# Altium schematic sheet interlinkP1B.SchDoc: Board-to-Board P1B
size Legal; CheckedBy: J. Brinton; CompanyName: Signal Laboratories, Inc.; DrawnBy: J. Brinton; Engineer: J. Brinton; Address1: 3479 Edison Way; Address2: Menlo Park CA 94025; Address3: +1 (877) 778-8435; Address4: siglabs.com; DocumentNumber: 43; Revision: 2b; SheetNumber: 44; SheetTotal: 58
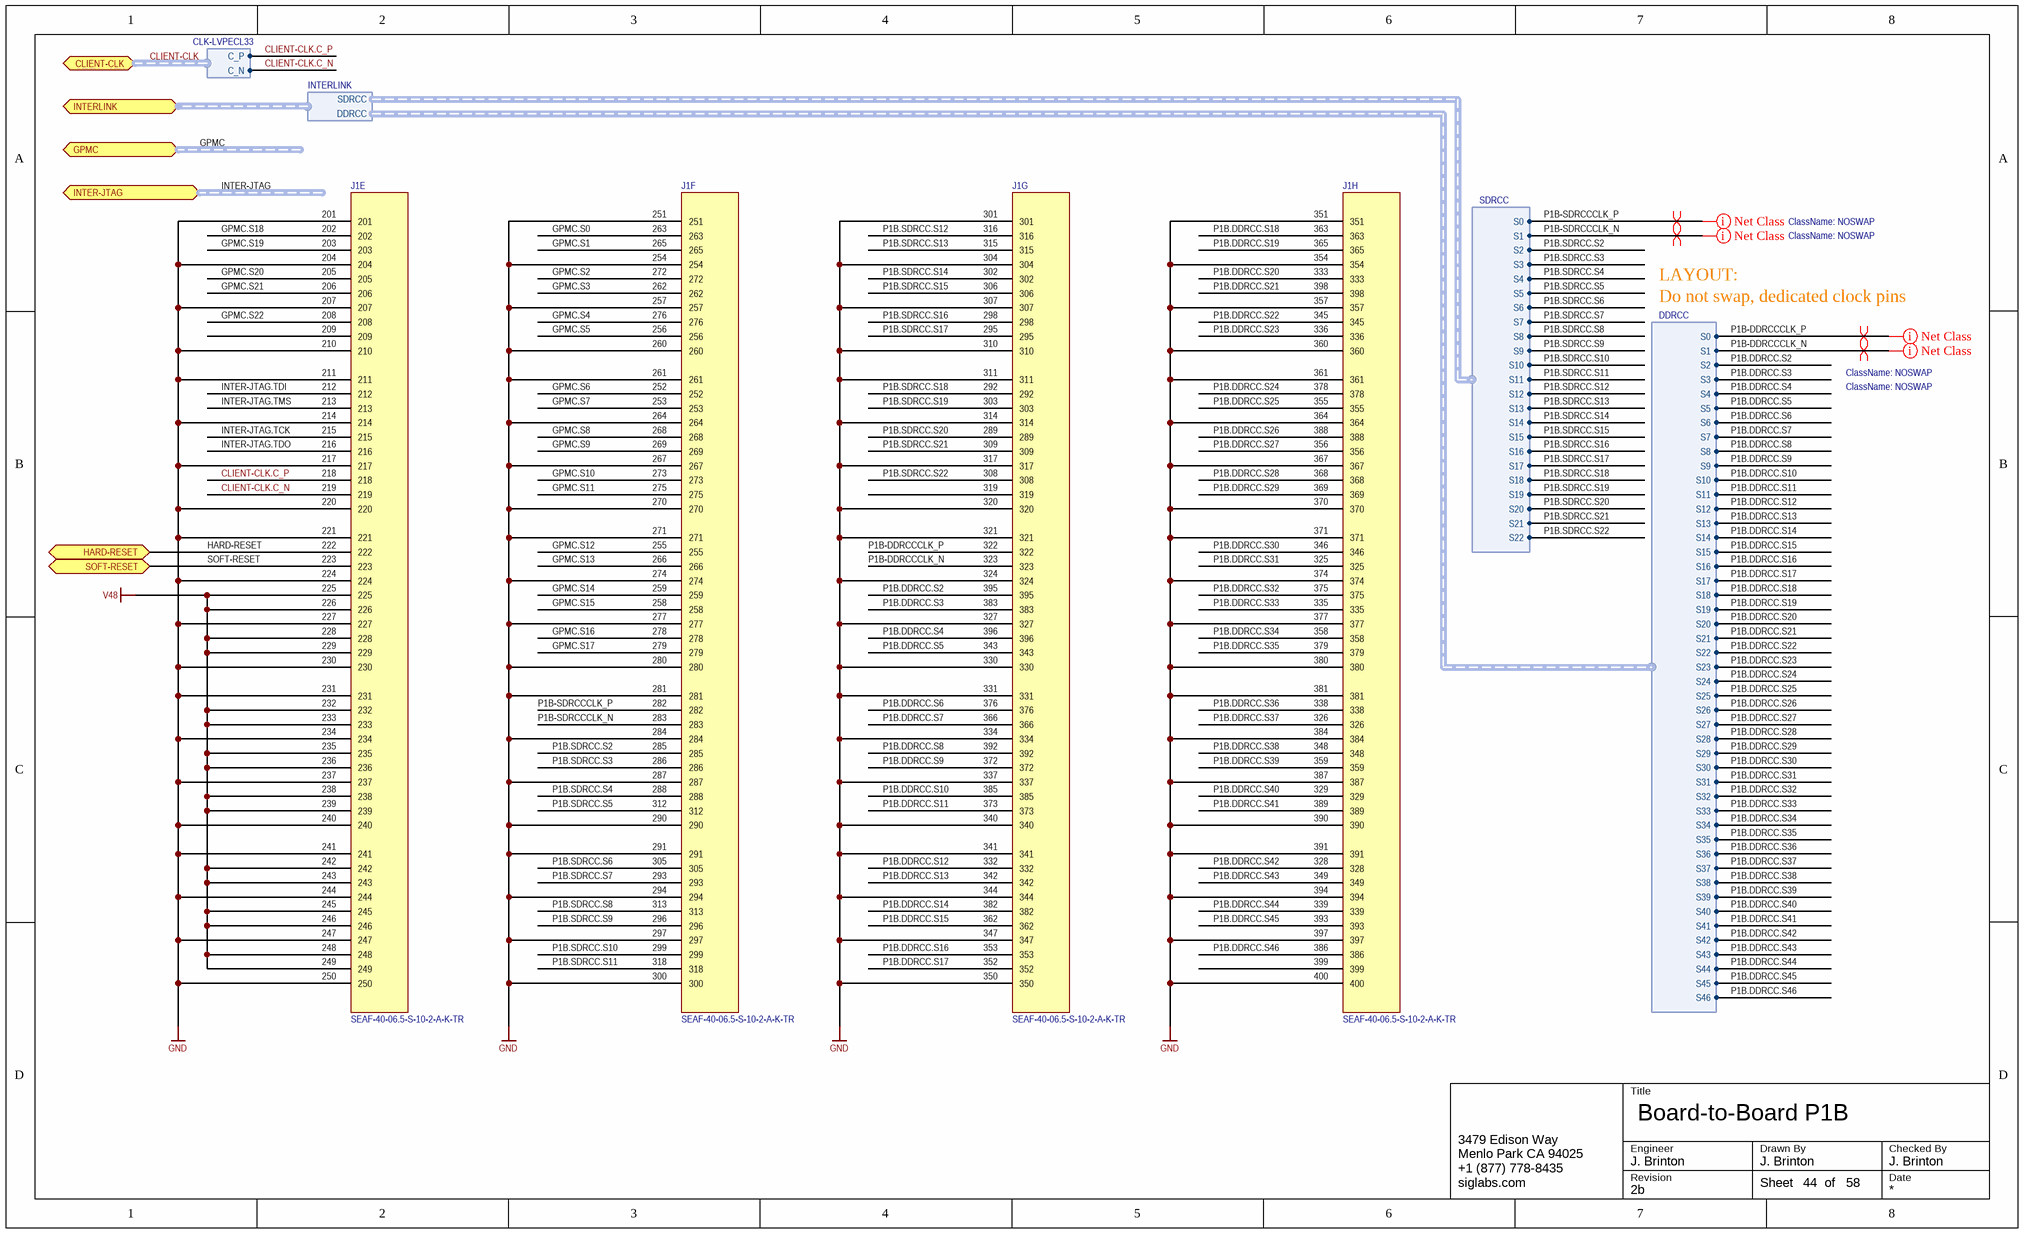
[diagram p0: interlinkP1B.SchDoc]

## Parts
J1  SEAF-40-06.5-S-10-2-A-K-TR  [SEAF-40-06.5-S-10-2-A-K-TR]  (parts E,F,G,H of 8)

## Ports
CLIENT-CLK (harness CLK-LVPECL33), GPMC (harness GPMC), HARD-RESET, INTER-JTAG (harness FPGA-JTAG), INTERLINK (harness INTERLINK), SOFT-RESET

## Harnesses
INTERLINK: DDRCC, SDRCC
DDRCC: S0, S1, S2, S3, S4, S5, S6, S7, S8, S9, S10, S11, S12, S13, S14, S15, S16, S17, S18, S19, S20, S21, S22, S23, S24, S25, S26, S27, S28, S29, S30, S31, S32, S33, S34, S35, S36, S37, S38, S39, S40, S41, S42, S43, S44, S45, S46
SDRCC: S0, S1, S2, S3, S4, S5, S6, S7, S8, S9, S10, S11, S12, S13, S14, S15, S16, S17, S18, S19, S20, S21, S22
CLK-LVPECL33: C_P, C_N

## Nets
GND: J1.201 J1.204 J1.207 J1.210 J1.211 J1.214 J1.217 J1.220 J1.221 J1.224 J1.227 J1.230 J1.231 J1.234 J1.237 J1.240 J1.241 J1.244 J1.247 J1.250 J1.251 J1.254 J1.257 J1.260 J1.261 J1.264 J1.267 J1.270 J1.271 J1.274 J1.277 J1.280 J1.281 J1.284 J1.287 J1.290 J1.291 J1.294 J1.297 J1.300 J1.301 J1.304 J1.307 J1.310 J1.311 J1.314 J1.317 J1.320 J1.321 J1.324 J1.327 J1.330 J1.331 J1.334 J1.337 J1.340 J1.341 J1.344 J1.347 J1.350 J1.351 J1.354 J1.357 J1.360 J1.361 J1.364 J1.367 J1.370 J1.371 J1.374 J1.377 J1.380 J1.381 J1.384 J1.387 J1.390 J1.391 J1.394 J1.397 J1.400
V48: J1.225 J1.226 J1.228 J1.229 J1.232 J1.233 J1.235 J1.236 J1.238 J1.239 J1.242 J1.243 J1.245 J1.246 J1.248 J1.249
CLIENT-CLK.C_N: J1.219 ; port CLIENT-CLK.C_N
CLIENT-CLK.C_P: J1.218 ; port CLIENT-CLK.C_P
GPMC.S0: J1.263
GPMC.S1: J1.265
GPMC.S2: J1.272
GPMC.S3: J1.262
GPMC.S4: J1.276
GPMC.S5: J1.256
GPMC.S6: J1.252
GPMC.S7: J1.253
GPMC.S8: J1.268
GPMC.S9: J1.269
GPMC.S10: J1.273
GPMC.S11: J1.275
GPMC.S12: J1.255
GPMC.S13: J1.266
GPMC.S14: J1.259
GPMC.S15: J1.258
GPMC.S16: J1.278
GPMC.S17: J1.279
GPMC.S18: J1.202
GPMC.S19: J1.203
GPMC.S20: J1.205
GPMC.S21: J1.206
GPMC.S22: J1.208
HARD-RESET: J1.222 ; port HARD-RESET
INTER-JTAG.TCK: J1.215
INTER-JTAG.TDI: J1.212
INTER-JTAG.TDO: J1.216
INTER-JTAG.TMS: J1.213
P1B-DDRCCCLK_N: J1.323 ; harness DDRCC.S1
P1B-DDRCCCLK_P: J1.322 ; harness DDRCC.S0
P1B-SDRCCCLK_N: J1.283 ; harness SDRCC.S1
P1B-SDRCCCLK_P: J1.282 ; harness SDRCC.S0
P1B.DDRCC.S2: J1.395 ; harness DDRCC.S2
P1B.DDRCC.S3: J1.383 ; harness DDRCC.S3
P1B.DDRCC.S4: J1.396 ; harness DDRCC.S4
P1B.DDRCC.S5: J1.343 ; harness DDRCC.S5
P1B.DDRCC.S6: J1.376 ; harness DDRCC.S6
P1B.DDRCC.S7: J1.366 ; harness DDRCC.S7
P1B.DDRCC.S8: J1.392 ; harness DDRCC.S8
P1B.DDRCC.S9: J1.372 ; harness DDRCC.S9
P1B.DDRCC.S10: J1.385 ; harness DDRCC.S10
P1B.DDRCC.S11: J1.373 ; harness DDRCC.S11
P1B.DDRCC.S12: J1.332 ; harness DDRCC.S12
P1B.DDRCC.S13: J1.342 ; harness DDRCC.S13
P1B.DDRCC.S14: J1.382 ; harness DDRCC.S14
P1B.DDRCC.S15: J1.362 ; harness DDRCC.S15
P1B.DDRCC.S16: J1.353 ; harness DDRCC.S16
P1B.DDRCC.S17: J1.352 ; harness DDRCC.S17
P1B.DDRCC.S18: J1.363 ; harness DDRCC.S18
P1B.DDRCC.S19: J1.365 ; harness DDRCC.S19
P1B.DDRCC.S20: J1.333 ; harness DDRCC.S20
P1B.DDRCC.S21: J1.398 ; harness DDRCC.S21
P1B.DDRCC.S22: J1.345 ; harness DDRCC.S22
P1B.DDRCC.S23: J1.336 ; harness DDRCC.S23
P1B.DDRCC.S24: J1.378 ; harness DDRCC.S24
P1B.DDRCC.S25: J1.355 ; harness DDRCC.S25
P1B.DDRCC.S26: J1.388 ; harness DDRCC.S26
P1B.DDRCC.S27: J1.356 ; harness DDRCC.S27
P1B.DDRCC.S28: J1.368 ; harness DDRCC.S28
P1B.DDRCC.S29: J1.369 ; harness DDRCC.S29
P1B.DDRCC.S30: J1.346 ; harness DDRCC.S30
P1B.DDRCC.S31: J1.325 ; harness DDRCC.S31
P1B.DDRCC.S32: J1.375 ; harness DDRCC.S32
P1B.DDRCC.S33: J1.335 ; harness DDRCC.S33
P1B.DDRCC.S34: J1.358 ; harness DDRCC.S34
P1B.DDRCC.S35: J1.379 ; harness DDRCC.S35
P1B.DDRCC.S36: J1.338 ; harness DDRCC.S36
P1B.DDRCC.S37: J1.326 ; harness DDRCC.S37
P1B.DDRCC.S38: J1.348 ; harness DDRCC.S38
P1B.DDRCC.S39: J1.359 ; harness DDRCC.S39
P1B.DDRCC.S40: J1.329 ; harness DDRCC.S40
P1B.DDRCC.S41: J1.389 ; harness DDRCC.S41
P1B.DDRCC.S42: J1.328 ; harness DDRCC.S42
P1B.DDRCC.S43: J1.349 ; harness DDRCC.S43
P1B.DDRCC.S44: J1.339 ; harness DDRCC.S44
P1B.DDRCC.S45: J1.393 ; harness DDRCC.S45
P1B.DDRCC.S46: J1.386 ; harness DDRCC.S46
P1B.SDRCC.S2: J1.285 ; harness SDRCC.S2
P1B.SDRCC.S3: J1.286 ; harness SDRCC.S3
P1B.SDRCC.S4: J1.288 ; harness SDRCC.S4
P1B.SDRCC.S5: J1.312 ; harness SDRCC.S5
P1B.SDRCC.S6: J1.305 ; harness SDRCC.S6
P1B.SDRCC.S7: J1.293 ; harness SDRCC.S7
P1B.SDRCC.S8: J1.313 ; harness SDRCC.S8
P1B.SDRCC.S9: J1.296 ; harness SDRCC.S9
P1B.SDRCC.S10: J1.299 ; harness SDRCC.S10
P1B.SDRCC.S11: J1.318 ; harness SDRCC.S11
P1B.SDRCC.S12: J1.316 ; harness SDRCC.S12
P1B.SDRCC.S13: J1.315 ; harness SDRCC.S13
P1B.SDRCC.S14: J1.302 ; harness SDRCC.S14
P1B.SDRCC.S15: J1.306 ; harness SDRCC.S15
P1B.SDRCC.S16: J1.298 ; harness SDRCC.S16
P1B.SDRCC.S17: J1.295 ; harness SDRCC.S17
P1B.SDRCC.S18: J1.292 ; harness SDRCC.S18
P1B.SDRCC.S19: J1.303 ; harness SDRCC.S19
P1B.SDRCC.S20: J1.289 ; harness SDRCC.S20
P1B.SDRCC.S21: J1.309 ; harness SDRCC.S21
P1B.SDRCC.S22: J1.308 ; harness SDRCC.S22
SOFT-RESET: J1.223 ; port SOFT-RESET

Not connected (* = marked no-connect by the designer): J1 209 319 399

## Buses and harness runs
harness CLIENT-CLK = port CLIENT-CLK
harness GPMC = port GPMC
harness INTER-JTAG = port INTER-JTAG

## Layout directives
net class NOSWAP: P1B-DDRCCCLK_N, P1B-DDRCCCLK_P, P1B-SDRCCCLK_N, P1B-SDRCCCLK_P
differential pair: P1B-DDRCCCLK_N, P1B-DDRCCCLK_P, P1B-SDRCCCLK_N, P1B-SDRCCCLK_P

## Notes on the sheet
- Do not swap, dedicated clock pins
- LAYOUT:
- Title
- Engineer
- Revision
- Drawn By
- Checked By
- Date
- Sheet
- of

## Library data of the parts
J1 = SEAF-40-06.5-S-10-2-A-K-TR: Terminal Array Assembly, Surface Mount, 0.050" Pitch, 400 Pins; Manufacturer: Samtec; Manufacturer P/N: SEAF-40-06.5-S-10-2-A-K-TR